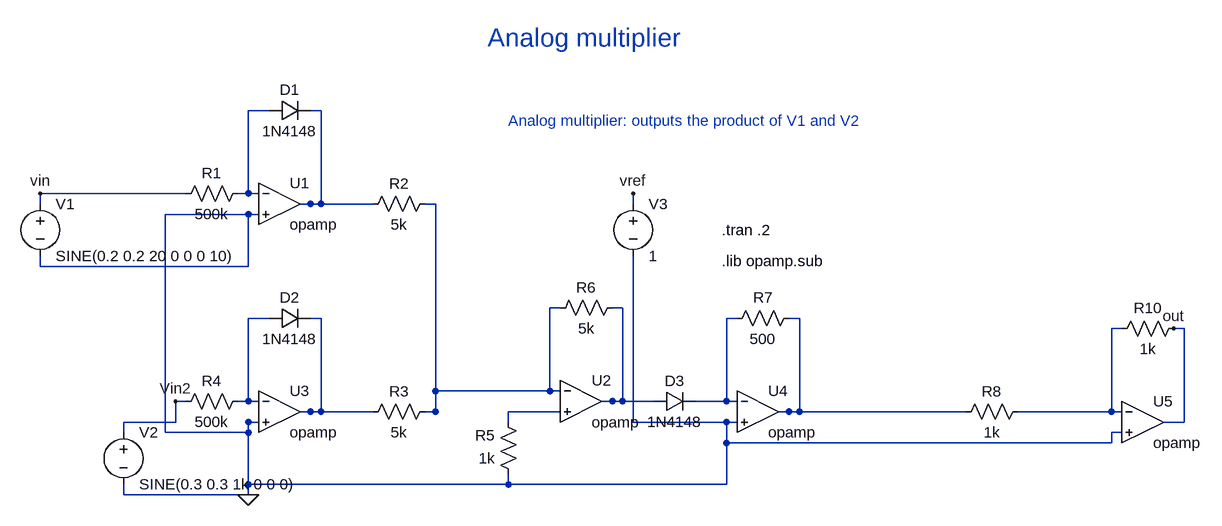
[diagram p0: schematic Analog-multiplier.asc]
Analog-multiplier.asc, the LTspice schematic file:
Version 4.1
SHEET 1 1636 952
WIRE 528 592 528 608
WIRE 144 192 128 192
WIRE 144 512 128 512
WIRE 880 512 864 512
WIRE 1472 528 1456 528
WIRE -192 256 -192 272
WIRE -64 608 -64 624
WIRE 720 256 720 272
WIRE 528 608 864 608
WIRE 864 608 864 512
WIRE 864 512 720 512
WIRE 720 512 720 272
WIRE 528 608 128 608
WIRE 128 608 128 512
WIRE 128 512 128 624
WIRE 128 624 -64 624
WIRE 128 512 128 528
WIRE 128 528 0 528
WIRE 0 528 0 192
WIRE 0 192 128 192
WIRE 128 192 128 272
WIRE 128 272 -192 272
WIRE 864 512 864 544
WIRE 864 544 1456 544
WIRE 1456 544 1456 528
FLAG 128 624 0
WIRE 160 32 144 32
WIRE 112 160 128 160
WIRE 144 160 128 160
WIRE 144 32 128 32
WIRE 128 32 128 160
WIRE 224 32 240 32
WIRE 320 176 304 176
WIRE 208 176 224 176
WIRE 240 32 240 176
WIRE 240 176 224 176
WIRE 224 176 304 176
WIRE 400 176 416 176
WIRE 400 496 416 496
WIRE 608 336 592 336
WIRE 608 464 592 464
WIRE 416 176 416 496
WIRE 416 496 416 464
WIRE 416 464 592 464
WIRE 592 464 592 336
WIRE 752 480 736 480
WIRE 688 336 704 336
WIRE 672 480 688 480
WIRE 736 480 688 480
WIRE 688 480 704 480
WIRE 704 480 704 336
WIRE 160 352 144 352
WIRE 112 480 128 480
WIRE 144 480 128 480
WIRE 144 352 128 352
WIRE 128 352 128 480
WIRE 224 352 240 352
WIRE 320 496 304 496
WIRE 208 496 224 496
WIRE 240 352 240 496
WIRE 240 496 224 496
WIRE 224 496 304 496
WIRE 816 480 832 480
WIRE 880 352 864 352
WIRE 880 480 864 480
WIRE 832 480 864 480
WIRE 864 480 864 352
WIRE 960 352 976 352
WIRE 1232 496 1216 496
WIRE 944 496 960 496
WIRE 976 352 976 496
WIRE 976 496 960 496
WIRE 960 496 1216 496
WIRE 1472 368 1456 368
WIRE 1312 496 1328 496
WIRE 1472 496 1456 496
WIRE 1456 368 1456 496
WIRE 1456 496 1328 496
WIRE 528 512 528 496
WIRE 608 496 592 496
WIRE 528 496 592 496
WIRE 32 480 16 480
WIRE -64 528 -64 512
WIRE 16 480 16 512
WIRE 16 512 -64 512
FLAG 16 480 Vin2
WIRE 1552 368 1568 368
WIRE 1536 512 1552 512
WIRE 1568 368 1568 512
WIRE 1568 512 1552 512
FLAG 1552 368 out
WIRE 32 160 16 160
WIRE -192 176 -192 160
WIRE 16 160 -192 160
FLAG -192 160 vin
WIRE 720 176 720 160
FLAG 720 160 vref
SYMBOL Opamps\\opamp 176 112 R0
SYMATTR InstName U1
SYMBOL voltage -192 160 R0
WINDOW 123 0 0 Left 2
WINDOW 39 0 0 Left 2
SYMATTR InstName V1
SYMATTR Value SINE(0.2 0.2 20 0 0 0 10)
SYMBOL res 128 144 R90
WINDOW 0 0 56 VBottom 2
WINDOW 3 32 56 VTop 2
SYMATTR InstName R1
SYMATTR Value 500k
SYMBOL diode 160 48 R270
WINDOW 0 32 32 VTop 2
WINDOW 3 0 32 VBottom 2
SYMATTR InstName D1
SYMATTR Value 1N4148
SYMBOL Opamps\\opamp 176 432 R0
SYMATTR InstName U3
SYMBOL res 128 464 R90
WINDOW 0 0 56 VBottom 2
WINDOW 3 32 56 VTop 2
SYMATTR InstName R4
SYMATTR Value 500k
SYMBOL res 416 160 R90
WINDOW 0 0 56 VBottom 2
WINDOW 3 32 56 VTop 2
SYMATTR InstName R2
SYMATTR Value 5k
SYMBOL res 416 480 R90
WINDOW 0 0 56 VBottom 2
WINDOW 3 32 56 VTop 2
SYMATTR InstName R3
SYMATTR Value 5k
SYMBOL res 544 608 R180
WINDOW 0 36 76 Left 2
WINDOW 3 36 40 Left 2
SYMATTR InstName R5
SYMATTR Value 1k
SYMBOL Opamps\\opamp 640 416 R0
SYMATTR InstName U2
SYMBOL res 704 320 R90
WINDOW 0 0 56 VBottom 2
WINDOW 3 32 56 VTop 2
SYMATTR InstName R6
SYMATTR Value 5k
SYMBOL Opamps\\opamp 912 432 R0
SYMATTR InstName U4
SYMBOL res 976 336 R90
WINDOW 0 0 56 VBottom 2
WINDOW 3 32 56 VTop 2
SYMATTR InstName R7
SYMATTR Value 500
SYMBOL res 1328 480 R90
WINDOW 0 0 56 VBottom 2
WINDOW 3 32 56 VTop 2
SYMATTR InstName R8
SYMATTR Value 1k
SYMBOL Opamps\\opamp 1504 448 R0
SYMATTR InstName U5
SYMBOL res 1568 352 R90
WINDOW 0 0 56 VBottom 2
WINDOW 3 32 56 VTop 2
SYMATTR InstName R10
SYMATTR Value 1k
SYMBOL diode 160 368 R270
WINDOW 0 32 32 VTop 2
WINDOW 3 0 32 VBottom 2
SYMATTR InstName D2
SYMATTR Value 1N4148
SYMBOL diode 752 496 R270
WINDOW 0 32 32 VTop 2
WINDOW 3 0 32 VBottom 2
SYMATTR InstName D3
SYMATTR Value 1N4148
SYMBOL voltage -64 512 R0
WINDOW 123 0 0 Left 2
WINDOW 39 0 0 Left 2
SYMATTR InstName V2
SYMATTR Value SINE(0.3 0.3 1k 0 0 0)
SYMBOL voltage 720 160 R0
WINDOW 123 0 0 Left 2
WINDOW 39 0 0 Left 2
SYMATTR InstName V3
SYMATTR Value 1
TEXT 856 264 Left 2 !.lib opamp.sub
TEXT 856 216 Left 2 !.tran .2
TEXT 528 48 Left 2 ;Analog multiplier: outputs the product of V1 and V2
TEXT 496 -80 Left 4 ;Analog multiplier

The netlist it stands for:
* Analog-multiplier.asc
X§U1 N001 0 N002 opamp Aol=100K GBW=10Meg  ; pins invin noninvin out
V1 vin 0 SINE(0.2 0.2 20 0 0 0 10)
R1 N001 vin 500k
D1 N001 N002 1N4148
X§U3 N005 0 N006 opamp Aol=100K GBW=10Meg  ; pins invin noninvin out
R4 N005 Vin2 500k
R2 N003 N002 5k
R3 N003 N006 5k
R5 0 N010 1k
X§U2 N003 N010 N004 opamp Aol=100K GBW=10Meg  ; pins invin noninvin out
R6 N004 N003 5k
X§U4 N007 0 N008 opamp Aol=100K GBW=10Meg  ; pins invin noninvin out
R7 N008 N007 500
R8 N009 N008 1k
X§U5 N009 0 out opamp Aol=100K GBW=10Meg  ; pins invin noninvin out
R10 out N009 1k
D2 N005 N006 1N4148
D3 N004 N007 1N4148
V2 Vin2 0 SINE(0.3 0.3 1k 0 0 0)
V3 vref 0 1
.model D D
.lib standard.dio
.lib opamp.sub
.tran .2
* Analog multiplier: outputs the product of V1 and V2
* Analog multiplier
.backanno
.end